# Altium schematic sheet MICROCONTROLLER.SchDoc
size A4 portrait
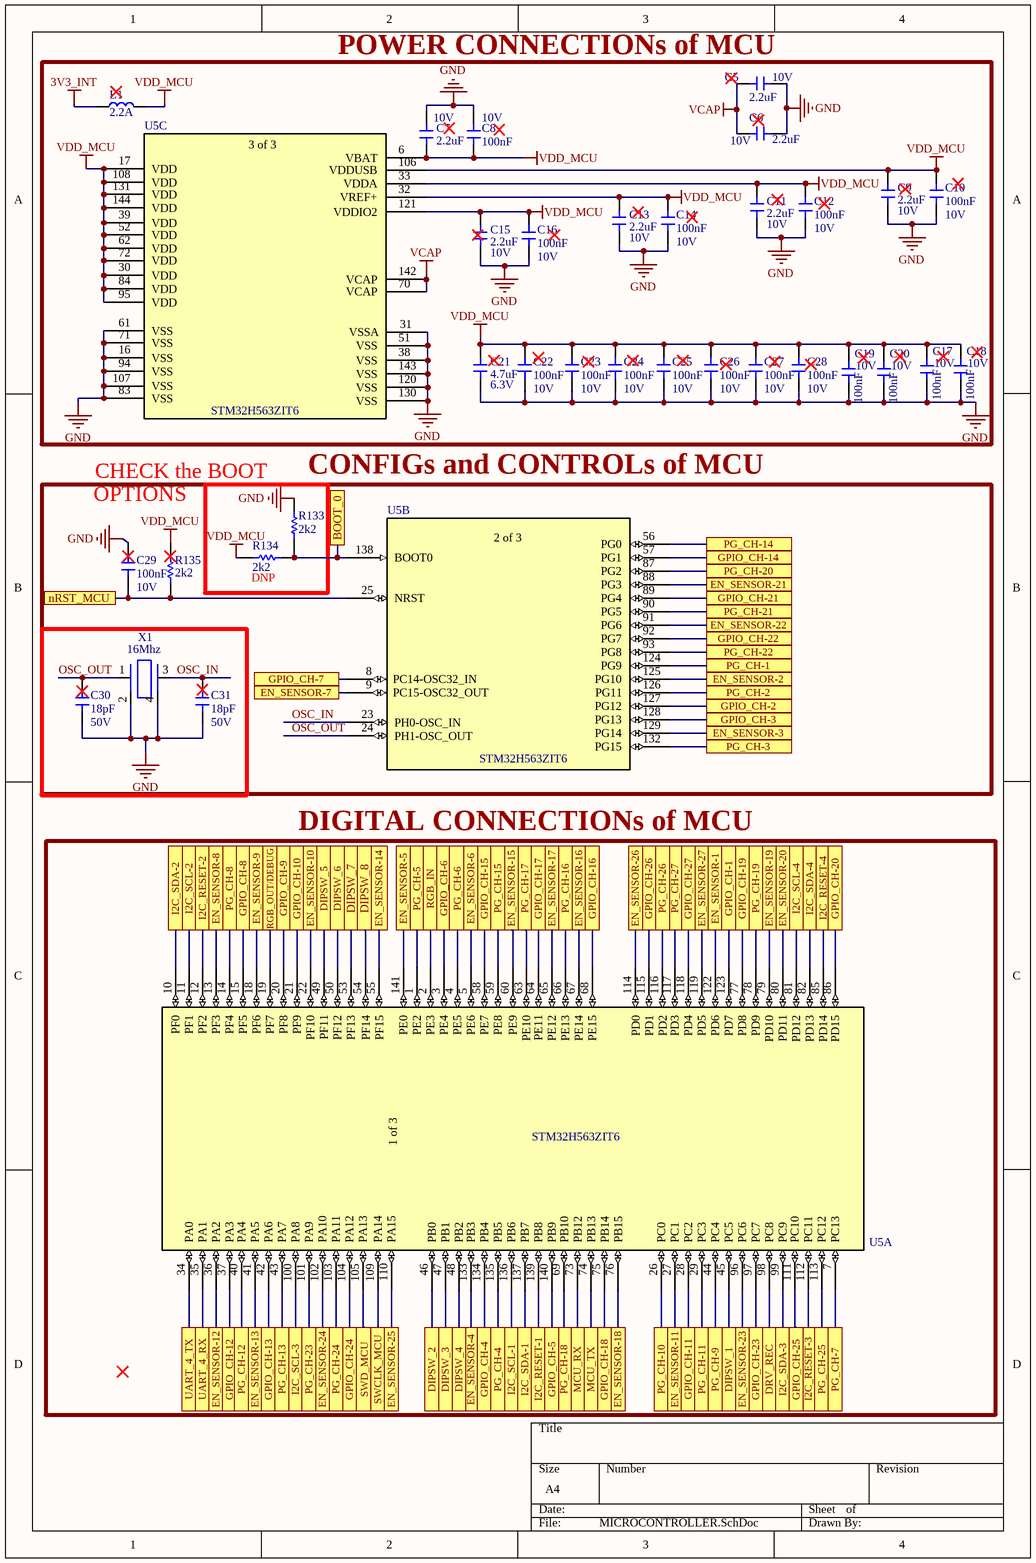
[diagram p0: MICROCONTROLLER.SchDoc]

## Parts
C5  value 2.2uF  Voltage: 10V  [CAP_0603_CER]  (hidden comment: CL10A225KP8NNNC)
C6  value 2.2uF  Voltage: 10V  [CAP_0603_CER]  (hidden comment: CL10A225KP8NNNC)
C7  value 2.2uF  Voltage: 10V  [CAP_0603_CER]  (hidden comment: CL10A225KP8NNNC)
C8  value 100nF  Voltage: 10V  [CAP_0402_CER]  (hidden comment: CL05B104KP5NNNC)
C9  value 2.2uF  Voltage: 10V  [CAP_0603_CER]  (hidden comment: CL10A225KP8NNNC)
C10  value 100nF  Voltage: 10V  [CAP_0402_CER]  (hidden comment: CL05B104KP5NNNC)
C11  value 2.2uF  Voltage: 10V  [CAP_0603_CER]  (hidden comment: CL10A225KP8NNNC)
C12  value 100nF  Voltage: 10V  [CAP_0402_CER]  (hidden comment: CL05B104KP5NNNC)
C13  value 2.2uF  Voltage: 10V  [CAP_0603_CER]  (hidden comment: CL10A225KP8NNNC)
C14  value 100nF  Voltage: 10V  [CAP_0402_CER]  (hidden comment: CL05B104KP5NNNC)
C15  value 2.2uF  Voltage: 10V  [CAP_0603_CER]  (hidden comment: CL10A225KP8NNNC)
C16  value 100nF  Voltage: 10V  [CAP_0402_CER]  (hidden comment: CL05B104KP5NNNC)
C17  value 100nF  Voltage: 10V  [CAP_0402_CER]  (hidden comment: CL05B104KP5NNNC)
C18  value 100nF  Voltage: 10V  [CAP_0402_CER]  (hidden comment: CL05B104KP5NNNC)
C19  value 100nF  Voltage: 10V  [CAP_0402_CER]  (hidden comment: CL05B104KP5NNNC)
C20  value 100nF  Voltage: 10V  [CAP_0402_CER]  (hidden comment: CL05B104KP5NNNC)
C21  value 4.7uF  Voltage: 6.3V  [CAP_0603_CER]  (hidden comment: CL10A475KP8NNNC)
C22  value 100nF  Voltage: 10V  [CAP_0402_CER]  (hidden comment: CL05B104KP5NNNC)
C23  value 100nF  Voltage: 10V  [CAP_0402_CER]  (hidden comment: CL05B104KP5NNNC)
C24  value 100nF  Voltage: 10V  [CAP_0402_CER]  (hidden comment: CL05B104KP5NNNC)
C25  value 100nF  Voltage: 10V  [CAP_0402_CER]  (hidden comment: CL05B104KP5NNNC)
C26  value 100nF  Voltage: 10V  [CAP_0402_CER]  (hidden comment: CL05B104KP5NNNC)
C27  value 100nF  Voltage: 10V  [CAP_0402_CER]  (hidden comment: CL05B104KP5NNNC)
C28  value 100nF  Voltage: 10V  [CAP_0402_CER]  (hidden comment: CL05B104KP5NNNC)
C29  value 100nF  Voltage: 10V  [CAP_0402_CER]  (hidden comment: CL05B104KP5NNNC)
C30  value 18pF  Voltage: 50V  [CAP_0402_CER]  (hidden comment: CC0402JRNPO9BN180)
C31  value 18pF  Voltage: 50V  [CAP_0402_CER]  (hidden comment: CC0402JRNPO9BN180)
L1  Power: 2.2A  [IND_0603_SMD]  (hidden comment: MPZ1608S221ATA00)
R133  value 2k2  [RES_0402_SMD]  (hidden comment: RMCF0402JT2K20)
R134  value 2k2  Place: DNP  [RES_0402_SMD]  (hidden comment: RMCF0402JT2K20)  (no BOM)
R135  value 2k2  [RES_0402_SMD]  (hidden comment: RMCF0402JT2K20)
U5  STM32H563ZIT6  [LQFP-144]  (parts A,B,C of 3)
X1  value 16Mhz  [XTAL-4SMD]  (hidden comment: CF4016M00009T1521005)

## Blocks framed on the sheet
POWER CONNECTIONs of MCU: C5-C28 L1 U5
CONFIGs and CONTROLs of MCU: R133 R134
DIGITAL CONNECTIONs of MCU: U5

## Ports
BOOT_0, DIPSW_1, DIPSW_2, DIPSW_3, DIPSW_4, DIPSW_5, DIPSW_6, DIPSW_7, DIPSW_8, DRV_REC, EN_SENSOR-1, EN_SENSOR-2, EN_SENSOR-3, EN_SENSOR-4, EN_SENSOR-5, EN_SENSOR-6, EN_SENSOR-7, EN_SENSOR-8, EN_SENSOR-9, EN_SENSOR-10, EN_SENSOR-11, EN_SENSOR-12, EN_SENSOR-13, EN_SENSOR-14, EN_SENSOR-15, EN_SENSOR-16, EN_SENSOR-17, EN_SENSOR-18, EN_SENSOR-19, EN_SENSOR-20, EN_SENSOR-21, EN_SENSOR-22, EN_SENSOR-23, EN_SENSOR-24, EN_SENSOR-25, EN_SENSOR-26, EN_SENSOR-27, GPIO_CH-1, GPIO_CH-2, GPIO_CH-3, GPIO_CH-4, GPIO_CH-5, GPIO_CH-6, GPIO_CH-7, GPIO_CH-8, GPIO_CH-9, GPIO_CH-10, GPIO_CH-11, GPIO_CH-12, GPIO_CH-13, GPIO_CH-14, GPIO_CH-15, GPIO_CH-16, GPIO_CH-17, GPIO_CH-18, GPIO_CH-19, GPIO_CH-20, GPIO_CH-21, GPIO_CH-22, GPIO_CH-23, GPIO_CH-24, GPIO_CH-25, GPIO_CH-26, GPIO_CH-27, I2C_RESET-1, I2C_RESET-2, I2C_RESET-3, I2C_RESET-4, I2C_SCL-1, I2C_SCL-2, I2C_SCL-3, I2C_SCL-4, I2C_SDA-1, I2C_SDA-2, I2C_SDA-3, I2C_SDA-4, MCU_RX, MCU_TX, nRST_MCU, PG_CH-1, PG_CH-2, PG_CH-3, PG_CH-4, PG_CH-5, PG_CH-6, PG_CH-7, PG_CH-8, PG_CH-9, PG_CH-10, PG_CH-11, PG_CH-12, PG_CH-13, PG_CH-14, PG_CH-15, PG_CH-16, PG_CH-17, PG_CH-18, PG_CH-19, PG_CH-20, PG_CH-21, PG_CH-22, PG_CH-23, PG_CH-24, PG_CH-25, PG_CH-26, PG_CH-27, RGB_IN, RGB_OUT/DEBUG, SWCLK_MCU, SWD_MCU, UART_4_RX, UART_4_TX

## Nets
3V3_INT: L1.1
GND: C5.1 C6.1 C7.2 C8.1 C9.1 C10.2 C11.1 C12.2 C13.1 C14.2 C15.1 C16.2 C17.2 C18.2 C19.2 C20.2 C21.1 C22.2 C23.2 C24.2 C25.2 C26.2 C27.2 C28.2 C29.1 C30.2 C31.2 R133.1 U5.16(VSS) U5.31(VSSA) U5.38(VSS) U5.51(VSS) U5.61(VSS) U5.71(VSS) U5.83(VSS) U5.94(VSS) U5.107(VSS) U5.120(VSS) U5.130(VSS) U5.143(VSS) X1.2 X1.4
VCAP: C5.2 C6.2 U5.70(VCAP) U5.142(VCAP)
VDD_MCU: C7.1 C8.2 C9.2 C10.1 C11.2 C12.1 C13.2 C14.1 C15.2 C16.1 C17.1 C18.1 C19.1 C20.1 C21.2 C22.1 C23.1 C24.1 C25.1 C26.1 C27.1 C28.1 L1.2 R134.2 R135.2 U5.6(VBAT) U5.17(VDD) U5.30(VDD) U5.32(VREF+) U5.33(VDDA) U5.39(VDD) U5.52(VDD) U5.62(VDD) U5.72(VDD) U5.84(VDD) U5.95(VDD) U5.106(VDDUSB) U5.108(VDD) U5.121(VDDIO2) U5.131(VDD) U5.144(VDD)
BOOT_0: R133.2 R134.1 U5.138(BOOT0) ; port BOOT_0
DIPSW_1: U5.45(PC5) ; port DIPSW_1
DIPSW_2: U5.46(PB0) ; port DIPSW_2
DIPSW_3: U5.47(PB1) ; port DIPSW_3
DIPSW_4: U5.48(PB2) ; port DIPSW_4
DIPSW_5: U5.49(PF11) ; port DIPSW_5
DIPSW_6: U5.50(PF12) ; port DIPSW_6
DIPSW_7: U5.53(PF13) ; port DIPSW_7
DIPSW_8: U5.54(PF14) ; port DIPSW_8
DRV_REC: U5.98(PC8) ; port DRV_REC
EN_SENSOR-1: U5.122(PD6) ; port EN_SENSOR-1
EN_SENSOR-2: U5.125(PG10) ; port EN_SENSOR-2
EN_SENSOR-3: U5.129(PG14) ; port EN_SENSOR-3
EN_SENSOR-4: U5.133(PB3) ; port EN_SENSOR-4
EN_SENSOR-5: U5.141(PE0) ; port EN_SENSOR-5
EN_SENSOR-6: U5.5(PE6) ; port EN_SENSOR-6
EN_SENSOR-7: U5.9(PC15-OSC32_OUT) ; port EN_SENSOR-7
EN_SENSOR-8: U5.13(PF3) ; port EN_SENSOR-8
EN_SENSOR-9: U5.18(PF6) ; port EN_SENSOR-9
EN_SENSOR-10: U5.22(PF10) ; port EN_SENSOR-10
EN_SENSOR-11: U5.27(PC1) ; port EN_SENSOR-11
EN_SENSOR-12: U5.36(PA2) ; port EN_SENSOR-12
EN_SENSOR-13: U5.41(PA5) ; port EN_SENSOR-13
EN_SENSOR-14: U5.55(PF15) ; port EN_SENSOR-14
EN_SENSOR-15: U5.60(PE9) ; port EN_SENSOR-15
EN_SENSOR-16: U5.67(PE14) ; port EN_SENSOR-16
EN_SENSOR-17: U5.65(PE12) ; port EN_SENSOR-17
EN_SENSOR-18: U5.76(PB15) ; port EN_SENSOR-18
EN_SENSOR-19: U5.79(PD10) ; port EN_SENSOR-19
EN_SENSOR-20: U5.80(PD11) ; port EN_SENSOR-20
EN_SENSOR-21: U5.88(PG3) ; port EN_SENSOR-21
EN_SENSOR-22: U5.91(PG6) ; port EN_SENSOR-22
EN_SENSOR-23: U5.96(PC6) ; port EN_SENSOR-23
EN_SENSOR-24: U5.102(PA10) ; port EN_SENSOR-24
EN_SENSOR-25: U5.110(PA15) ; port EN_SENSOR-25
EN_SENSOR-26: U5.114(PD0) ; port EN_SENSOR-26
EN_SENSOR-27: U5.119(PD5) ; port EN_SENSOR-27
GPIO_CH-1: U5.123(PD7) ; port GPIO_CH-1
GPIO_CH-2: U5.127(PG12) ; port GPIO_CH-2
GPIO_CH-3: U5.128(PG13) ; port GPIO_CH-3
GPIO_CH-4: U5.134(PB4) ; port GPIO_CH-4
GPIO_CH-5: U5.140(PB9) ; port GPIO_CH-5
GPIO_CH-6: U5.3(PE4) ; port GPIO_CH-6
GPIO_CH-7: U5.8(PC14-OSC32_IN) ; port GPIO_CH-7
GPIO_CH-8: U5.15(PF5) ; port GPIO_CH-8
GPIO_CH-9: U5.20(PF8) ; port GPIO_CH-9
GPIO_CH-10: U5.21(PF9) ; port GPIO_CH-10
GPIO_CH-11: U5.28(PC2) ; port GPIO_CH-11
GPIO_CH-12: U5.37(PA3) ; port GPIO_CH-12
GPIO_CH-13: U5.42(PA6) ; port GPIO_CH-13
GPIO_CH-14: U5.57(PG1) ; port GPIO_CH-14
GPIO_CH-15: U5.58(PE7) ; port GPIO_CH-15
GPIO_CH-16: U5.68(PE15) ; port GPIO_CH-16
GPIO_CH-17: U5.64(PE11) ; port GPIO_CH-17
GPIO_CH-18: U5.75(PB14) ; port GPIO_CH-18
GPIO_CH-19: U5.77(PD8) ; port GPIO_CH-19
GPIO_CH-20: U5.86(PD15) ; port GPIO_CH-20
GPIO_CH-21: U5.89(PG4) ; port GPIO_CH-21
GPIO_CH-22: U5.92(PG7) ; port GPIO_CH-22
GPIO_CH-23: U5.97(PC7) ; port GPIO_CH-23
GPIO_CH-24: U5.104(PA12) ; port GPIO_CH-24
GPIO_CH-25: U5.111(PC10) ; port GPIO_CH-25
GPIO_CH-26: U5.115(PD1) ; port GPIO_CH-26
GPIO_CH-27: U5.118(PD4) ; port GPIO_CH-27
I2C_RESET-1: U5.139(PB8) ; port I2C_RESET-1
I2C_RESET-2: U5.12(PF2) ; port I2C_RESET-2
I2C_RESET-3: U5.112(PC11) ; port I2C_RESET-3
I2C_RESET-4: U5.85(PD14) ; port I2C_RESET-4
I2C_SCL-1: U5.136(PB6) ; port I2C_SCL-1
I2C_SCL-2: U5.11(PF1) ; port I2C_SCL-2
I2C_SCL-3: U5.100(PA8) ; port I2C_SCL-3
I2C_SCL-4: U5.81(PD12) ; port I2C_SCL-4
I2C_SDA-1: U5.137(PB7) ; port I2C_SDA-1
I2C_SDA-2: U5.10(PF0) ; port I2C_SDA-2
I2C_SDA-3: U5.99(PC9) ; port I2C_SDA-3
I2C_SDA-4: U5.82(PD13) ; port I2C_SDA-4
MCU_RX: U5.73(PB12) ; port MCU_RX
MCU_TX: U5.74(PB13) ; port MCU_TX
nRST_MCU: C29.2 R135.1 U5.25(NRST) ; port nRST_MCU
OSC_IN: C31.1 U5.23(PH0-OSC_IN) X1.3
OSC_OUT: C30.1 U5.24(PH1-OSC_OUT) X1.1
PG_CH-1: U5.124(PG9) ; port PG_CH-1
PG_CH-2: U5.126(PG11) ; port PG_CH-2
PG_CH-3: U5.132(PG15) ; port PG_CH-3
PG_CH-4: U5.135(PB5) ; port PG_CH-4
PG_CH-5: U5.1(PE2) ; port PG_CH-5
PG_CH-6: U5.4(PE5) ; port PG_CH-6
PG_CH-7: U5.7(PC13) ; port PG_CH-7
PG_CH-8: U5.14(PF4) ; port PG_CH-8
PG_CH-9: U5.44(PC4) ; port PG_CH-9
PG_CH-10: U5.26(PC0) ; port PG_CH-10
PG_CH-11: U5.29(PC3) ; port PG_CH-11
PG_CH-12: U5.40(PA4) ; port PG_CH-12
PG_CH-13: U5.43(PA7) ; port PG_CH-13
PG_CH-14: U5.56(PG0) ; port PG_CH-14
PG_CH-15: U5.59(PE8) ; port PG_CH-15
PG_CH-16: U5.66(PE13) ; port PG_CH-16
PG_CH-17: U5.63(PE10) ; port PG_CH-17
PG_CH-18: U5.69(PB10) ; port PG_CH-18
PG_CH-19: U5.78(PD9) ; port PG_CH-19
PG_CH-20: U5.87(PG2) ; port PG_CH-20
PG_CH-21: U5.90(PG5) ; port PG_CH-21
PG_CH-22: U5.93(PG8) ; port PG_CH-22
PG_CH-23: U5.101(PA9) ; port PG_CH-23
PG_CH-24: U5.103(PA11) ; port PG_CH-24
PG_CH-25: U5.113(PC12) ; port PG_CH-25
PG_CH-26: U5.116(PD2) ; port PG_CH-26
PG_CH-27: U5.117(PD3) ; port PG_CH-27
RGB_IN: U5.2(PE3) ; port RGB_IN
RGB_OUT/DEBUG: U5.19(PF7) ; port RGB_OUT/DEBUG
SWCLK_MCU: U5.109(PA14) ; port SWCLK_MCU
SWD_MCU: U5.105(PA13) ; port SWD_MCU
UART_4_RX: U5.35(PA1) ; port UART_4_RX
UART_4_TX: U5.34(PA0) ; port UART_4_TX

## Notes on the sheet
- OPTIONS
- CHECK the BOOT
- (in symbol STM32H563ZIT6, part A) 1 of 3
- (in symbol STM32H563ZIT6, part B) 2 of 3
- (in symbol STM32H563ZIT6, part C) 3 of 3

## Library data of the parts
C5-C7 C9 C11 C13 C15 = CAP_GEN_CER: 2.2uF 0603 Ceramic Capacitor; Place: POP; Part Number: CL10A225KP8NNNC; Power: *; Package: *; Tolerance: *; Operating Temp.: *
C8 C10 C12 C14 C16-C20 C22-C29 = CAP_GEN_CER: 100nF 0402 Ceramic Capacitor; Place: POP; Part Number: CL05B104KP5NNNC; Power: *; Package: *; Tolerance: *; Operating Temp.: *
C21 = CAP_GEN_CER: 4,7uF 0603 Ceramic Capacitor; Place: POP; Part Number: CL10A475KP8NNNC; Power: *; Package: *; Tolerance: *; Operating Temp.: *
C30 C31 = CAP_GEN_CER: 18pF 0402 Ceramic Capacitor; Place: POP; Part Number: CC0402JRNPO9BN180; Power: *; Package: *; Tolerance: *; Operating Temp.: *
L1 = IND_GEN_SMD: Generic SMD IND/BEAD; Manufacturer: TDK; Value: 220 Ohms @ 100 MHz; Place: POP; Part Number: MPZ1608S221ATA00; Package: 0603; Tolerance: N/A; Voltage: N/A; Operating Temp.: -55°C ~ 125°C
R133 R135 = RES_GEN_SMD: Generic Chip Res 2k2; Tolerance: 5 %; Place: POP; Package: *; Part Number: RMCF0402JT2K20; Power: *; Voltage: *; Operating Temp.: *
R134 = RES_GEN_SMD: Generic Chip Res 2k2; Tolerance: 5 %; Package: *; Part Number: RMCF0402JT2K20; Power: *; Voltage: *; Operating Temp.: *
U5 = STM32H563ZIT6: ARM® Cortex®-M33 STM32H5 Microcontroller IC 32-Bit 250MHz 2MB (2M x 8) FLASH 144-LQFP (20x20) / ); Manufacturer: STM; Voltage: 1.7-3.6 V; Operatin Temp.: -40°C ~ 85°; Place: P; Part Number: STM32H563ZIT6; Value: N/A; Power: N/A; Tolerance: N/A; Package: LQFP-144
X1 = XTAL-4PINs: 16 MHz ±10ppm Crystal 9pF 40 Ohms 4-SMD, No Lead; Manufacturer: Hefei Jingweite Electronics Co., Ltd.; Place: POP; Voltage: N/A; Tolerance: ±10ppm; Power: N/A; Part Number: CF4016M00009T1521005; Operating Temp.: -40°C ~ 125°C